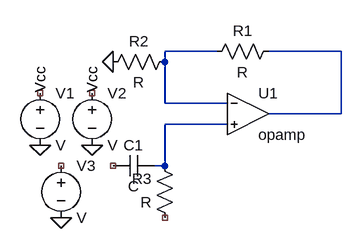
[diagram p0: schematic Low_pass.asc]
Low_pass.asc, the LTspice schematic file:
Version 4
SHEET 1 880 680
WIRE 224 80 144 80
WIRE 416 80 304 80
WIRE 144 96 144 80
WIRE 144 160 144 96
WIRE 240 160 144 160
WIRE 416 176 416 80
WIRE 416 176 304 176
WIRE 240 192 144 192
WIRE 144 256 144 192
WIRE 144 256 128 256
FLAG -48 224 0
FLAG 32 224 0
FLAG -16 336 0
FLAG 64 96 0
SYMBOL OpAmps\\opamp 272 112 R0
SYMATTR InstName U1
SYMBOL res 320 64 R90
WINDOW 0 0 56 VBottom 2
WINDOW 3 32 56 VTop 2
SYMATTR InstName R1
SYMBOL res 160 80 R90
WINDOW 0 0 56 VBottom 2
WINDOW 3 32 56 VTop 2
SYMATTR InstName R2
SYMBOL res 160 352 R180
WINDOW 0 36 76 Left 2
WINDOW 3 36 40 Left 2
SYMATTR InstName R3
SYMBOL voltage 32 128 R0
SYMATTR InstName V2
SYMBOL voltage -16 240 R0
SYMATTR InstName V3
SYMBOL cap 128 240 R90
WINDOW 0 0 32 VBottom 2
WINDOW 3 32 32 VTop 2
SYMATTR InstName C1
SYMBOL voltage -48 128 R0
SYMATTR InstName V1
TEXT 32 144 VLeft 2 !Vcc
TEXT -48 144 VLeft 2 !Vcc

The netlist it stands for:
* Low_pass.asc
XU1 N001 N003 N002 opamp Aol=100K GBW=10Meg  ; pins invin noninvin out
R1 N002 N001 R
R2 N001 0 R
R3 NC_01 N003 R
V2 NC_02 0 V
V3 NC_03 0 V
C1 N003 NC_04 C
V1 NC_05 0 V
Vcc
Vcc
.backanno
.end